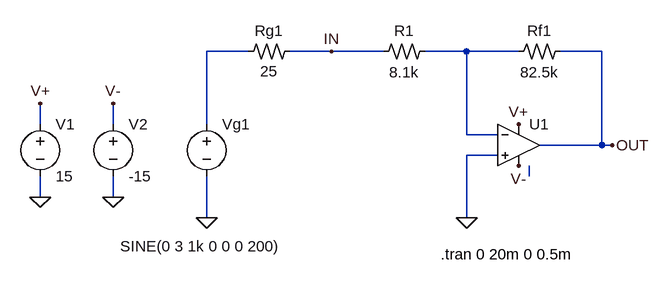
[diagram p0: schematic OPAMP.asc]
OPAMP.asc, the LTspice schematic file:
Version 4
SHEET 1 880 680
WIRE 0 16 -64 16
WIRE 128 16 64 16
WIRE 208 16 128 16
WIRE 336 16 272 16
WIRE 416 16 336 16
WIRE 544 16 480 16
WIRE -320 128 -320 96
WIRE -208 128 -208 96
WIRE -64 128 -64 16
WIRE 336 144 336 16
WIRE 384 144 336 144
WIRE 544 160 544 16
WIRE 544 160 448 160
WIRE 560 160 544 160
WIRE 384 176 336 176
WIRE 432 208 432 192
WIRE -320 240 -320 208
WIRE -208 240 -208 208
WIRE -64 272 -64 208
WIRE 336 272 336 176
FLAG -320 240 0
FLAG -208 240 0
FLAG -320 96 V+
FLAG -208 96 V-
FLAG 336 272 0
FLAG 560 160 OUT
FLAG 128 16 IN
FLAG 416 192 V-
FLAG 416 128 V+
FLAG -64 272 0
SYMBOL voltage -320 112 R0
WINDOW 123 24 126 Left 2
WINDOW 39 24 111 Left 2
SYMATTR InstName V1
SYMATTR Value 15
SYMBOL voltage -208 112 R0
WINDOW 123 24 126 Left 2
WINDOW 39 24 111 Left 2
SYMATTR InstName V2
SYMATTR Value -15
SYMBOL Opamps/UniversalOpamp2 416 160 R0
SYMATTR InstName U1
SYMBOL res2 272 0 R90
WINDOW 0 0 32 VBottom 2
WINDOW 3 32 32 VTop 2
SYMATTR InstName R1
SYMATTR Value 8.1k
SYMBOL res2 480 0 R90
WINDOW 0 0 32 VBottom 2
WINDOW 3 32 32 VTop 2
SYMATTR InstName Rf1
SYMATTR Value 82.5k
SYMBOL res2 64 0 R90
WINDOW 0 0 32 VBottom 2
WINDOW 3 31 32 VTop 2
SYMATTR InstName Rg1
SYMATTR Value 25
SYMBOL voltage -64 112 R0
WINDOW 3 -133 204 Left 2
WINDOW 123 0 0 Left 0
WINDOW 39 0 0 Left 0
SYMATTR Value SINE(0 3 1k 0 0 0 200)
SYMATTR InstName Vg1
TEXT 296 328 Left 2 !.tran 0 20m 0 0.5m

The netlist it stands for:
* OPAMP.asc
V1 V+ 0 15
V2 V- 0 -15
XU1 0 N002 V+ V- OUT level.2 Avol=1Meg GBW=10Meg Slew=10Meg ilimit=25m rail=0 Vos=0 phimargin=45 en=0 enk=0 in=0 ink=0 Rin=500Meg  ; pins IN+ IN- V+ V- OUT
R1 N002 IN 8.1k
Rf1 OUT N002 82.5k
Rg1 IN N001 25
Vg1 N001 0 SINE(0 3 1k 0 0 0 200)
.tran 0 20m 0 0.5m
.lib UniversalOpamps2.sub
.backanno
.end